# EAGLE design bar-graph-driver-16x9-ca-v2 (EAGLE 7.4.0)
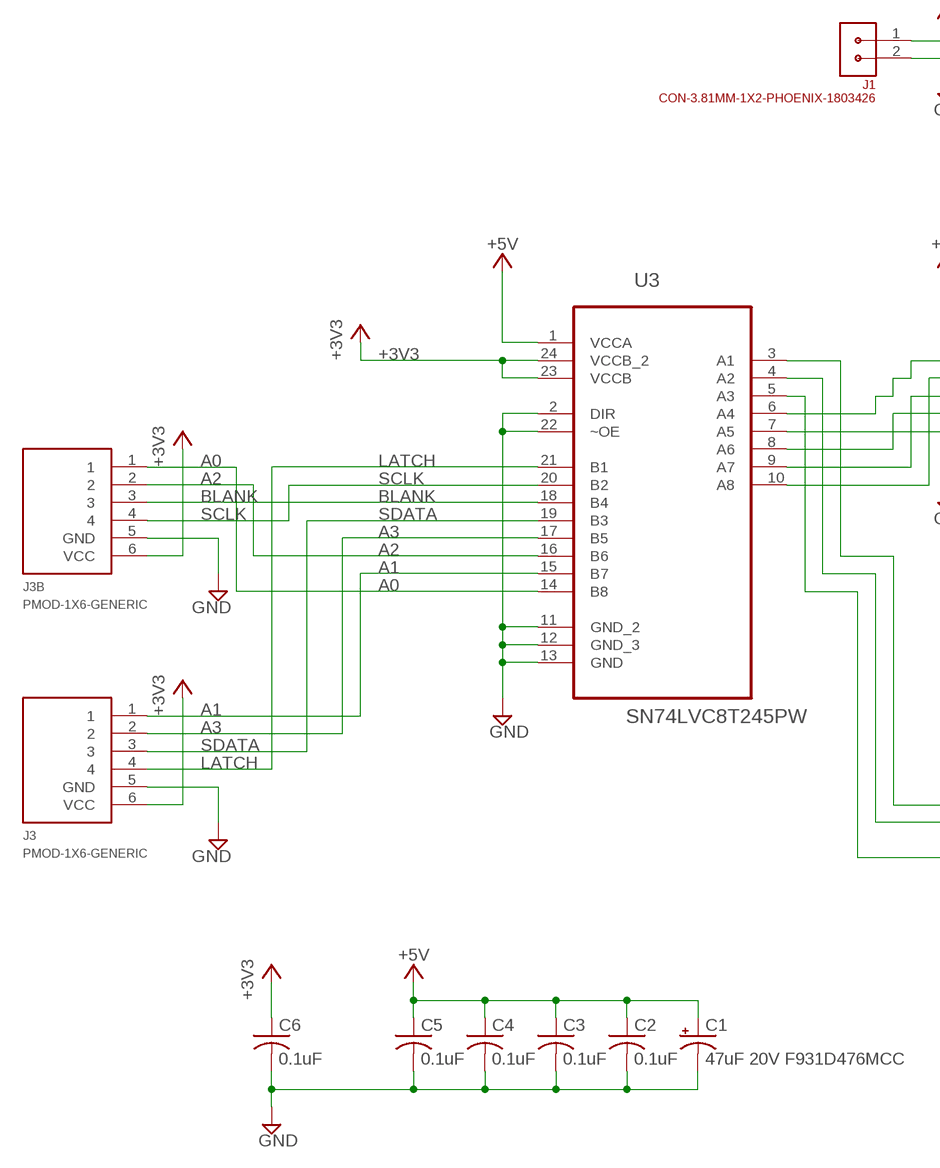
[diagram p0: schematic, sheet 1, part 1 of 2]
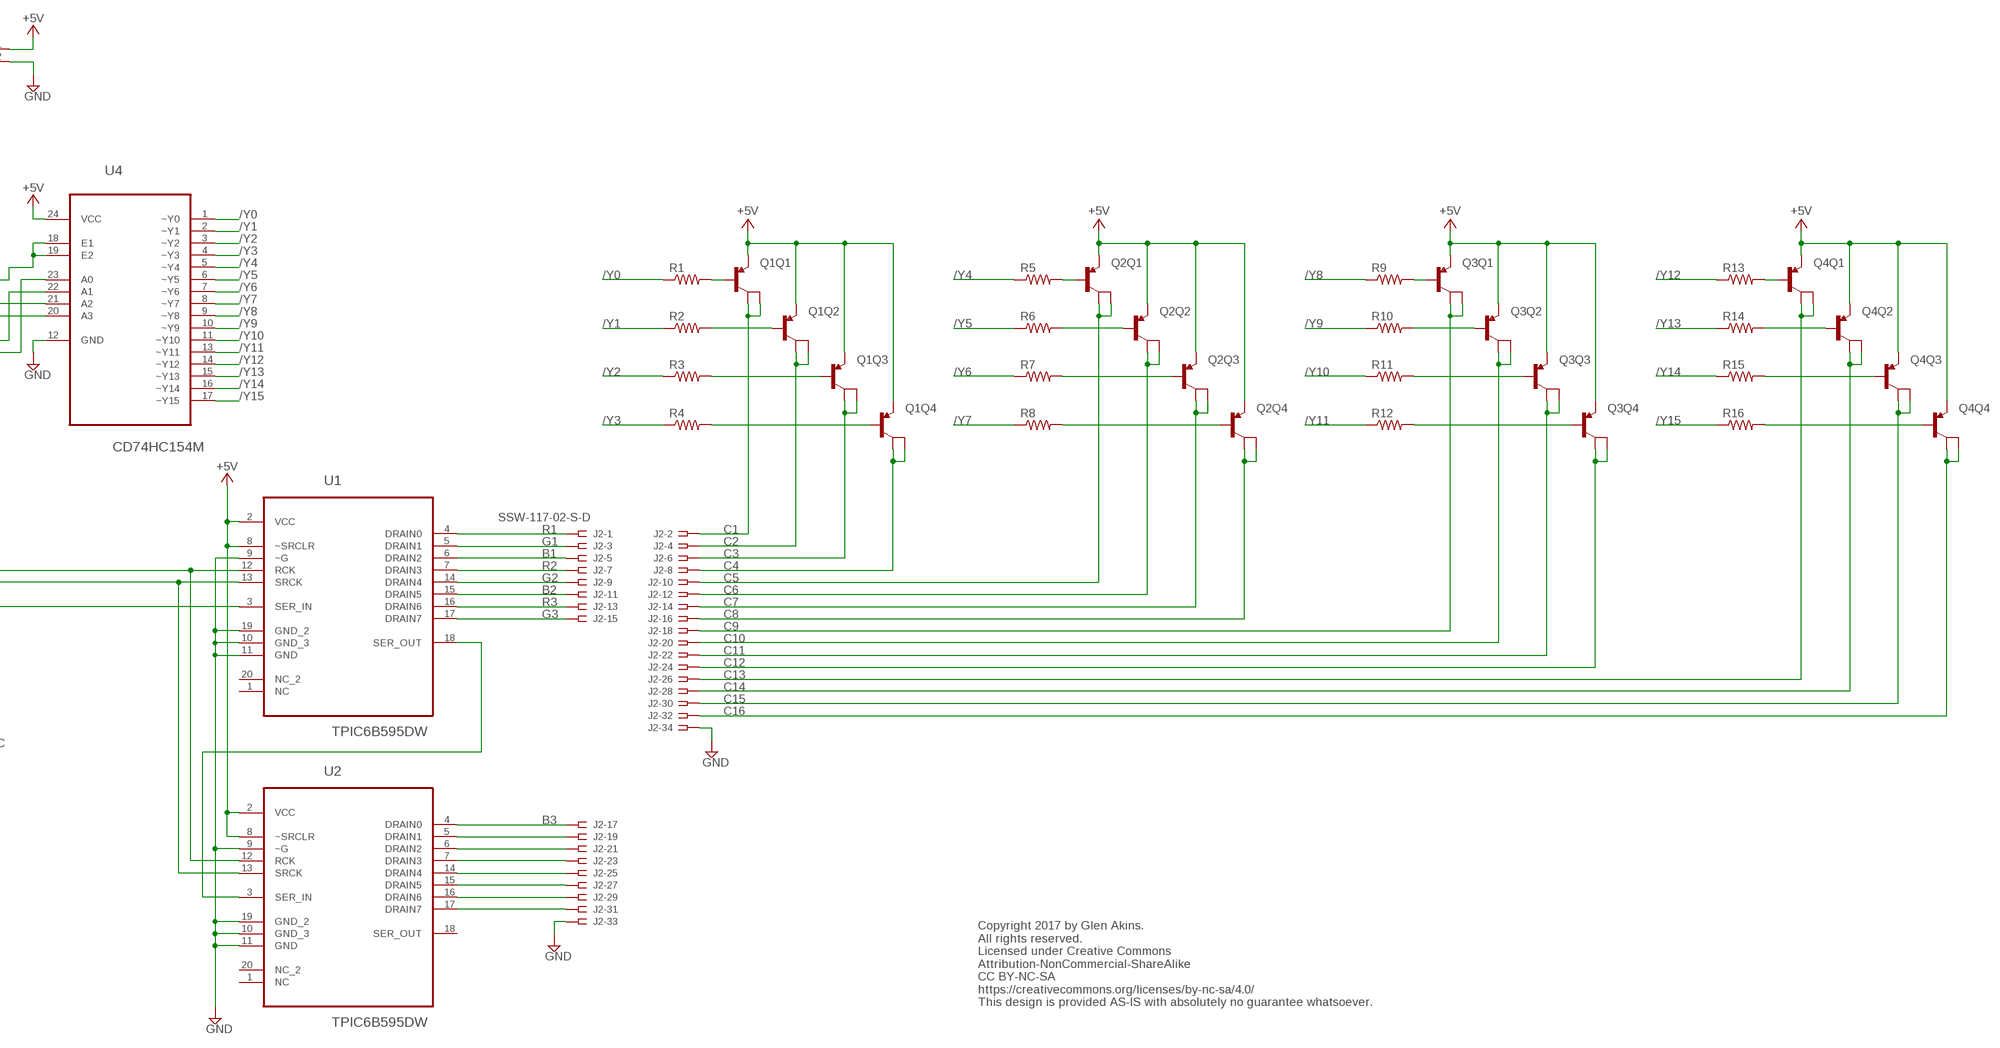
[diagram p1: schematic, sheet 1, part 2 of 2]

## Parts
C1  47uF 20V F931D476MCC  CPOL-USC/6032-28R  [C/6032-28R]
C2  0.1uF  C-USC1206  [C1206]
C3  0.1uF  C-USC1206  [C1206]
C4  0.1uF  C-USC1206  [C1206]
C5  0.1uF  C-USC1206  [C1206]
C6  0.1uF  C-USC1206  [C1206]
J1  CON-3.81MM-1X2-PHOENIX-1803426  [CON-PHOENIX-1803426-3.81-1X2]
J2  SSW-117-02-S-D  [SSW-117-02-S-D]
J3  PMOD-1X6-GENERIC  [CON-PMOD-1X6]
J3B  PMOD-1X6-GENERIC  [CON-PMOD-1X6]
Q1  MMPQ2907A  [SO16]
Q2  MMPQ2907A  [SO16]
Q3  MMPQ2907A  [SO16]
Q4  MMPQ2907A  [SO16]
R1  R-US_R1206  [R1206]
R2  R-US_R1206  [R1206]
R3  R-US_R1206  [R1206]
R4  R-US_R1206  [R1206]
R5  R-US_R1206  [R1206]
R6  R-US_R1206  [R1206]
R7  R-US_R1206  [R1206]
R8  R-US_R1206  [R1206]
R9  R-US_R1206  [R1206]
R10  R-US_R1206  [R1206]
R11  R-US_R1206  [R1206]
R12  R-US_R1206  [R1206]
R13  R-US_R1206  [R1206]
R14  R-US_R1206  [R1206]
R15  R-US_R1206  [R1206]
R16  R-US_R1206  [R1206]
U1  TPIC6B595DW  [SOIC127P1030X265-20N]
U2  TPIC6B595DW  [SOIC127P1030X265-20N]
U3  SN74LVC8T245PW  SN74AVC8T245PW  [SOP65P640X120-24N]
U4  CD74HC154M  [SOIC127P1030X265-24N]

## Nets
+3V3: C6.1 J3.6(VCC) J3B.6(VCC) U3.23(VCCB) U3.24(VCCB_2)
+5V: C1.+ C2.1 C3.1 C4.1 C5.1 J1.1 Q1.10(Q4:E) Q1.12(Q3:E) Q1.14(Q2:E) Q1.16(Q1:E) Q2.10(Q4:E) Q2.12(Q3:E) Q2.14(Q2:E) Q2.16(Q1:E) Q3.10(Q4:E) Q3.12(Q3:E) Q3.14(Q2:E) Q3.16(Q1:E) Q4.10(Q4:E) Q4.12(Q3:E) Q4.14(Q2:E) Q4.16(Q1:E) U1.2(VCC) U1.8(~SRCLR) U2.2(VCC) U2.8(~SRCLR) U3.1(VCCA) U4.24(VCC)
/Y0: R1.1 U4.1(~Y0)
/Y1: R2.1 U4.2(~Y1)
/Y2: R3.1 U4.3(~Y2)
/Y3: R4.1 U4.4(~Y3)
/Y4: R5.1 U4.5(~Y4)
/Y5: R6.1 U4.6(~Y5)
/Y6: R7.1 U4.7(~Y6)
/Y7: R8.1 U4.8(~Y7)
/Y8: R9.1 U4.9(~Y8)
/Y9: R10.1 U4.10(~Y9)
/Y10: R11.1 U4.11(~Y10)
/Y11: R12.1 U4.13(~Y11)
/Y12: R13.1 U4.14(~Y12)
/Y13: R14.1 U4.15(~Y13)
/Y14: R15.1 U4.16(~Y14)
/Y15: R16.1 U4.17(~Y15)
A0: J3B.1 U3.14(B8)
A0_5: U3.10(A8) U4.23(A0)
A1: J3.1 U3.15(B7)
A1_5: U3.9(A7) U4.22(A1)
A2: J3B.2 U3.16(B6)
A2_5: U3.8(A6) U4.21(A2)
A3: J3.2 U3.17(B5)
A3_5: U3.7(A5) U4.20(A3)
B1: J2.5 U1.6(DRAIN2)
B2: J2.11 U1.15(DRAIN5)
B3: J2.17 U2.4(DRAIN0)
BLANK: J3B.3 U3.18(B4)
BLANK_5: U3.6(A4) U4.18(E1) U4.19(E2)
C1: J2.2 Q1.1(Q1:C) Q1.2(Q1:C)
C2: J2.4 Q1.3(Q2:C) Q1.4(Q2:C)
C3: J2.6 Q1.5(Q3:C) Q1.6(Q3:C)
C4: J2.8 Q1.7(Q4:C) Q1.8(Q4:C)
C5: J2.10 Q2.1(Q1:C) Q2.2(Q1:C)
C6: J2.12 Q2.3(Q2:C) Q2.4(Q2:C)
C7: J2.14 Q2.5(Q3:C) Q2.6(Q3:C)
C8: J2.16 Q2.7(Q4:C) Q2.8(Q4:C)
C9: J2.18 Q3.1(Q1:C) Q3.2(Q1:C)
C10: J2.20 Q3.3(Q2:C) Q3.4(Q2:C)
C11: J2.22 Q3.5(Q3:C) Q3.6(Q3:C)
C12: J2.24 Q3.7(Q4:C) Q3.8(Q4:C)
C13: J2.26 Q4.1(Q1:C) Q4.2(Q1:C)
C14: J2.28 Q4.3(Q2:C) Q4.4(Q2:C)
C15: J2.30 Q4.5(Q3:C) Q4.6(Q3:C)
C16: J2.32 Q4.7(Q4:C) Q4.8(Q4:C)
G1: J2.3 U1.5(DRAIN1)
G2: J2.9 U1.14(DRAIN4)
G3: J2.15 U1.17(DRAIN7)
GND: C1.- C2.2 C3.2 C4.2 C5.2 C6.2 J1.2 J2.33 J2.34 J3.5(GND) J3B.5(GND) U1.9(~G) U1.10(GND_3) U1.11(GND) U1.19(GND_2) U2.9(~G) U2.10(GND_3) U2.11(GND) U2.19(GND_2) U3.2(DIR) U3.11(GND_2) U3.12(GND_3) U3.13(GND) U3.22(~OE) U4.12(GND)
LATCH: J3.4 U3.21(B1)
LATCH_5: U1.12(RCK) U2.12(RCK) U3.3(A1)
N$1: U1.18(SER_OUT) U2.3(SER_IN)
N$2: J2.19 U2.5(DRAIN1)
N$3: J2.21 U2.6(DRAIN2)
N$6: J2.23 U2.7(DRAIN3)
N$7: J2.25 U2.14(DRAIN4)
N$8: J2.27 U2.15(DRAIN5)
N$9: J2.29 U2.16(DRAIN6)
N$10: J2.31 U2.17(DRAIN7)
N$20: Q1.13(Q2:B) R2.2
N$82: Q1.11(Q3:B) R3.2
N$83: Q1.9(Q4:B) R4.2
N$84: Q1.15(Q1:B) R1.2
N$102: Q2.13(Q2:B) R6.2
N$103: Q2.11(Q3:B) R7.2
N$104: Q2.9(Q4:B) R8.2
N$105: Q2.15(Q1:B) R5.2
N$110: Q3.13(Q2:B) R10.2
N$111: Q3.11(Q3:B) R11.2
N$112: Q3.9(Q4:B) R12.2
N$113: Q3.15(Q1:B) R9.2
N$118: Q4.13(Q2:B) R14.2
N$119: Q4.11(Q3:B) R15.2
N$120: Q4.9(Q4:B) R16.2
N$121: Q4.15(Q1:B) R13.2
R1: J2.1 U1.4(DRAIN0)
R2: J2.7 U1.7(DRAIN3)
R3: J2.13 U1.16(DRAIN6)
SCLK: J3B.4 U3.20(B2)
SCLK_5: U1.13(SRCK) U2.13(SRCK) U3.4(A2)
SDATA: J3.3 U3.19(B3)
SDATA_5: U1.3(SER_IN) U3.5(A3)
Unconnected: U1.1(NC) U1.20(NC_2) U2.1(NC) U2.18(SER_OUT) U2.20(NC_2)

## Notes on the sheet
- Copyright 2017 by Glen Akins.
  All rights reserved.
  Licensed under Creative Commons
  Attribution-NonCommercial-ShareAlike
  CC BY-NC-SA
  https://creativecommons.org/licenses/by-nc-sa/4.0/
  This design is provided AS-IS with absolutely no guarantee whatsoever.

## Library data of the parts
C1 = rcl:CPOL-US: POLARIZED CAPACITOR, American symbol
C2-C6 = rcl:C-US: CAPACITOR, American symbol
J1 = 0GlenConnectors:CON-3.81MM-1X2-PHOENIX-1803426
J2 = con-samtec:SSW-117-02-S-D: THROUGH-HOLE .025" SQ POST SOCKET Source: Samtec SSW.pdf; MPN: SSW-117-02-S-D; OC_FARNELL: unknown; OC_NEWARK: 11P9590
J3 J3B = 0GlenConnectors:PMOD-1X6-GENERIC
Q1-Q4 = GlenPartsLibrary:MMPQ2907A
R1-R16 = rcl:R-US_: RESISTOR, American symbol
U1 U2 = Texas Instruments_By_element14_Batch_1:TPIC6B595DW: Power Logic 8-Bit Shift Register; MPN: TPIC6B595DW; OC_FARNELL: 1491696; OC_NEWARK: 52F2783; PACKAGE: SOIC-20; SUPPLIER: Texas Instruments
U3 = Texas Instruments_By_element14_Batch_1:SN74AVC8T245PW: TRANSCEIVER; MPN: SN74AVC8T245PW; OC_FARNELL: 1053490; OC_NEWARK: 10J9626; PACKAGE: TSSOP-24; SUPPLIER: Texas Instruments
U4 = Texas Instruments_By_element14_Batch_1:CD74HC154M: High-Speed CMOS Logic 4- to 16-Line Decoder/Demultiplexer; MPN: CD74HC154M; OC_FARNELL: 1640550; OC_NEWARK: 66F5185; PACKAGE: SOIC-24; SUPPLIER: Texas Instruments

## Board
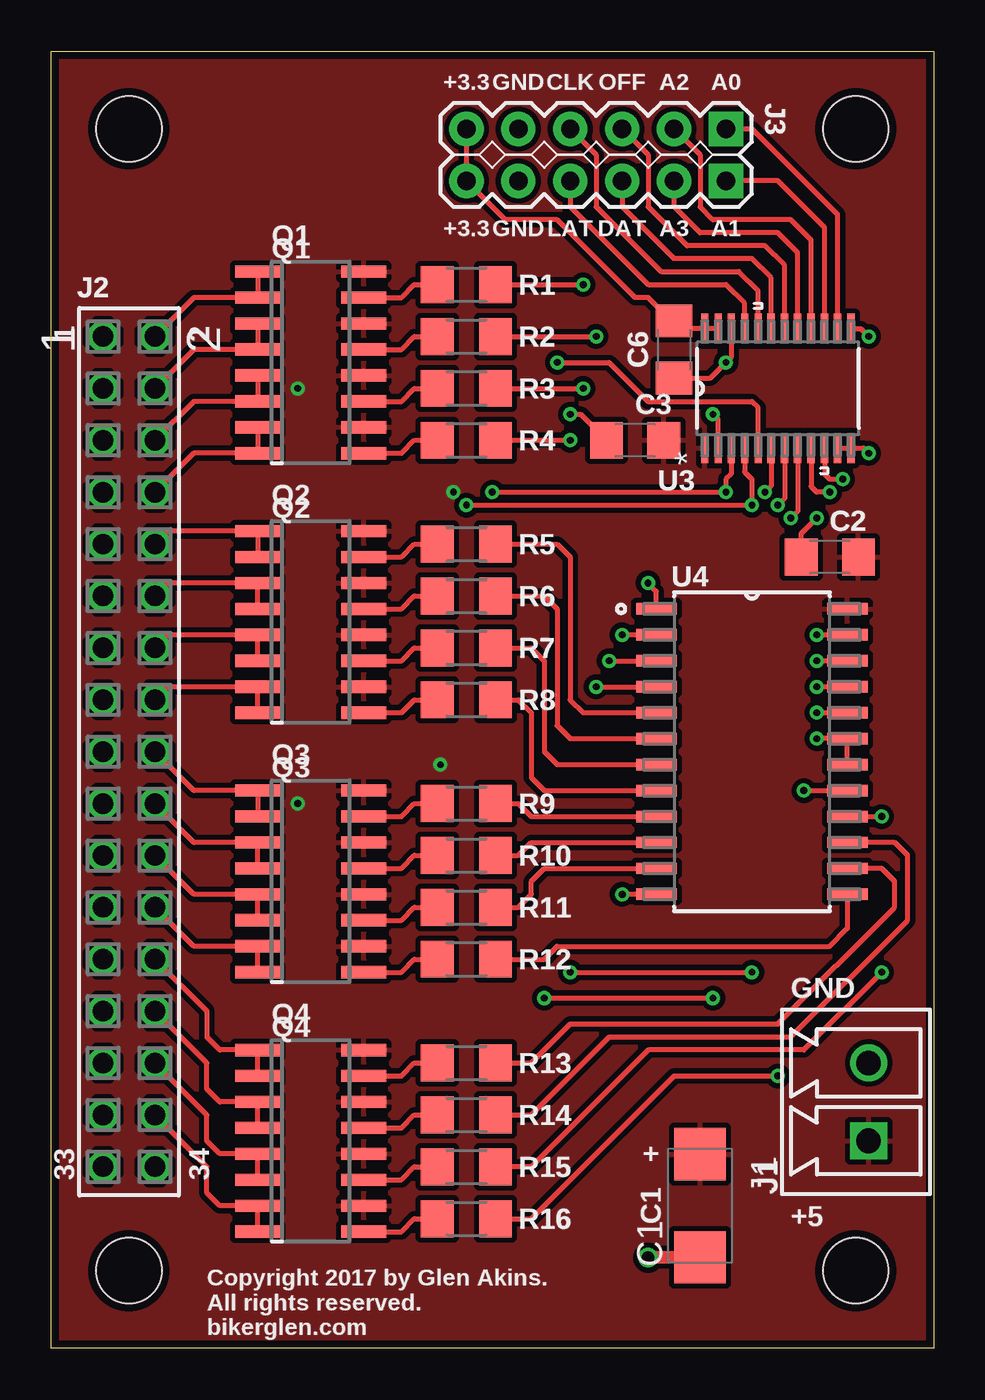
[diagram p2: board, top side]
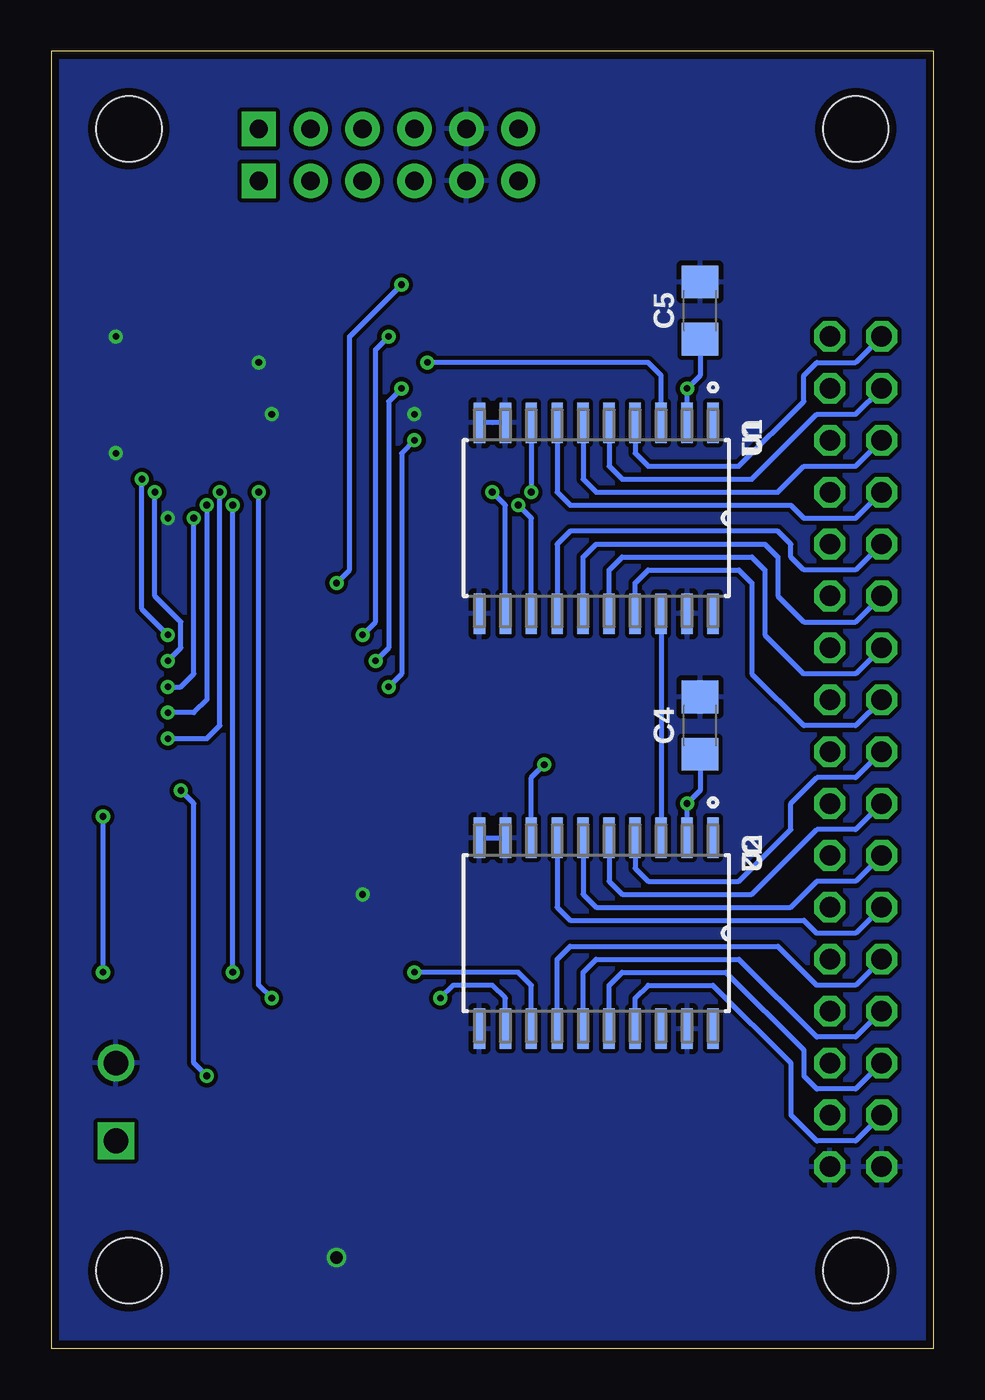
[diagram p3: board, bottom side, seen from below]

Size 43.18 x 63.5 mm. Coordinates in mm from the lower left corner, seen from the top.
Outline: 0,0 0,63.5 43.18,63.5 43.18,0 0,0
Copper layers (1*16): Top 0.0356mm / dielectric 1.5011mm / Bottom 0.0356mm
Design rules "oshpark-2layer": minimum track width 6mil, minimum drill 13mil, track to track 6mil, track to pad 6mil, pad to pad 6mil, via to via 6mil, smd to smd 6mil, copper to edge 15mil, drill to drill 6mil, minimum pad ring 7mil, minimum via ring 7mil, stop-mask expansion 2.5mil, vias tented up to drill 0mil, thermal gap 10mil
Holes 3.2 mm at 3.81,3.81 3.81,59.69 39.37,59.69 39.37,3.81

### Footprints (pad centres in the part's own frame; a part is rotated, then mirrored left to right if it is on the bottom)
C/6032-28R = smd 2.55 x 2.5: + 2.525,0; - -2.525,0
C1206 = smd 1.6 x 1.8: 1 -1.4,0; 2 1.4,0
CON-PHOENIX-1803426-3.81-1X2 = drill 1.2 square: 1 0,0 | drill 1.2: 2 3.81,0
SSW-117-02-S-D = drill 1 pad 1.5 octagon: 1 -20.32,-1.27; 2 -20.32,1.27; 3 -17.78,-1.27; 4 -17.78,1.27; 5 -15.24,-1.27; 6 -15.24,1.27; 7 -12.7,-1.27; 8 -12.7,1.27; 9 -10.16,-1.27; 10 -10.16,1.27; 11 -7.62,-1.27; 12 -7.62,1.27; 13 -5.08,-1.27; 14 -5.08,1.27; 15 -2.54,-1.27; 16 -2.54,1.27; 17 0,-1.27; 18 0,1.27; 19 2.54,-1.27; 20 2.54,1.27; 21 5.08,-1.27; 22 5.08,1.27; 23 7.62,-1.27; 24 7.62,1.27; 25 10.16,-1.27; 26 10.16,1.27; 27 12.7,-1.27; 28 12.7,1.27; 29 15.24,-1.27; 30 15.24,1.27; 31 17.78,-1.27; 32 17.78,1.27; 33 20.32,-1.27; 34 20.32,1.27
CON-PMOD-1X6 = drill 0.9 pad 1.676 square: 1 0,6.35 | drill 0.9 pad 1.676: 2 0,3.81; 3 0,1.27; 4 0,-1.27; 5 0,-3.81; 6 0,-6.35
SO16 = smd 0.6 x 2.2: 1 -4.445,-2.6; 2 -3.175,-2.6; 3 -1.905,-2.6; 4 -0.635,-2.6; 5 0.635,-2.6; 6 1.905,-2.6; 7 3.175,-2.6; 8 4.445,-2.6; 9 4.445,2.6; 10 3.175,2.6; 11 1.905,2.6; 12 0.635,2.6; 13 -0.635,2.6; 14 -1.905,2.6; 15 -3.175,2.6; 16 -4.445,2.6
R1206 = smd 1.6 x 1.803: 1 -1.422,0; 2 1.422,0
SOIC127P1030X265-20N = smd 1.981 x 0.559: 1 -4.674,5.715; 2 -4.674,4.445; 3 -4.674,3.175; 4 -4.674,1.905; 5 -4.674,0.635; 6 -4.674,-0.635; 7 -4.674,-1.905; 8 -4.674,-3.175; 9 -4.674,-4.445; 10 -4.674,-5.715; 11 4.674,-5.715; 12 4.674,-4.445; 13 4.674,-3.175; 14 4.674,-1.905; 15 4.674,-0.635; 16 4.674,0.635; 17 4.674,1.905; 18 4.674,3.175; 19 4.674,4.445; 20 4.674,5.715
SOP65P640X120-24N = smd 1.473 x 0.356: 1 -2.921,3.581; 2 -2.921,2.921; 3 -2.921,2.286; 4 -2.921,1.626; 5 -2.921,0.965; 6 -2.921,0.33; 7 -2.921,-0.33; 8 -2.921,-0.965; 9 -2.921,-1.626; 10 -2.921,-2.286; 11 -2.921,-2.921; 12 -2.921,-3.581; 13 2.921,-3.581; 14 2.921,-2.921; 15 2.921,-2.286; 16 2.921,-1.626; 17 2.921,-0.965; 18 2.921,-0.33; 19 2.921,0.33; 20 2.921,0.965; 21 2.921,1.626; 22 2.921,2.286; 23 2.921,2.921; 24 2.921,3.581
SOIC127P1030X265-24N = smd 1.981 x 0.559: 1 -4.674,6.985; 2 -4.674,5.715; 3 -4.674,4.445; 4 -4.674,3.175; 5 -4.674,1.905; 6 -4.674,0.635; 7 -4.674,-0.635; 8 -4.674,-1.905; 9 -4.674,-3.175; 10 -4.674,-4.445; 11 -4.674,-5.715; 12 -4.674,-6.985; 13 4.674,-6.985; 14 4.674,-5.715; 15 4.674,-4.445; 16 4.674,-3.175; 17 4.674,-1.905; 18 4.674,-0.635; 19 4.674,0.635; 20 4.674,1.905; 21 4.674,3.175; 22 4.674,4.445; 23 4.674,5.715; 24 4.674,6.985

### Placement (x,y rotation side)
C1  31.75,6.99 90 top
C2  38.1,38.73 180 top
C3  28.57,44.45 180 top
C4  11.43,30.48 90 bottom
C5  11.43,50.8 90 bottom
C6  30.48,48.9 270 top
J1  40.01,10.16 90 top
J2  3.81,29.21 270 top
J3  26.67,57.15 270 top
J3B  26.67,59.69 270 top
Q1  12.7,48.26 270 top
Q2  12.7,35.56 270 top
Q3  12.7,22.86 270 top
Q4  12.7,10.16 270 top
R1  20.32,52.07 180 top
R2  20.32,49.53 180 top
R3  20.32,46.99 180 top
R4  20.32,44.45 180 top
R5  20.32,39.37 180 top
R6  20.32,36.83 180 top
R7  20.32,34.29 180 top
R8  20.32,31.75 180 top
R9  20.32,26.67 180 top
R10  20.32,24.13 180 top
R11  20.32,21.59 180 top
R12  20.32,19.05 180 top
R13  20.32,13.97 180 top
R14  20.32,11.43 180 top
R15  20.32,8.89 180 top
R16  20.32,6.35 180 top
U1  16.51,40.64 270 bottom
U2  16.51,20.32 270 bottom
U3  35.56,46.99 90 top
U4  34.29,29.21 0 top

### Tracks (layer width: path | path; a pad name or v marks a point on that pad's centre or on a via)
+3V3
  Top 0.254: J3B.6 J3.6 22.23,55.24 24.77,55.24 28.57,51.44 29.21,51.44 30.35,50.3 C6.1 30.86,49.91 U3.24 U3.23
+5V  (via drill 0.33)
  Bottom 0.254: U2.2 v12.06,26.67 11.43,27.3 C4.1 | U1.2 v12.06,46.99 11.43,47.62 C5.1 | U1.8 v19.68,41.91 | U2.8 19.68,27.94 v19.05,28.57
  pour Top (isolate 0.254): 0,63.5 43.18,63.5 43.18,0 0,0
/Y0  (via drill 0.33)
  Top 0.254: R1.1 v26.04,52.07 | U4.1 29.62,37.06 v29.21,37.47
  Bottom 0.254: v29.21,37.47 28.57,38.1 28.57,49.53 v26.04,52.07
/Y1  (via drill 0.33)
  Top 0.254: R2.1 v26.67,49.53 | U4.2 v27.94,34.92
  Bottom 0.254: v27.94,34.92 27.3,35.56 27.3,48.9 v26.67,49.53
/Y2  (via drill 0.33)
  Top 0.254: R3.1 v26.04,46.99 | v27.3,33.66 U4.3
  Bottom 0.254: v26.04,46.99 26.67,46.35 26.67,34.29 v27.3,33.66
/Y3  (via drill 0.33)
  Top 0.254: R4.1 v25.4,44.45 | v26.67,32.38 U4.4
  Bottom 0.254: v25.4,44.45 26.04,43.81 26.04,33.02 v26.67,32.38
/Y4
  Top 0.254: R5.1 24.77,39.37 25.4,38.73 25.4,31.75 26.04,31.11 U4.5
/Y5
  Top 0.254: R6.1 24.13,36.83 24.77,36.2 24.77,30.48 25.4,29.84 U4.6
/Y6
  Top 0.254: R7.1 23.5,34.29 24.13,33.66 24.13,29.21 24.77,28.57 U4.7
/Y7
  Top 0.254: R8.1 22.86,31.75 23.5,31.11 23.5,27.94 24.13,27.3 U4.8
/Y8
  Top 0.254: R9.1 22.86,26.67 23.5,26.04 U4.9
/Y9
  Top 0.254: R10.1 22.86,24.13 23.5,24.77 U4.10
/Y10
  Top 0.254: R11.1 22.86,21.59 23.5,22.23 23.5,22.86 24.13,23.5 U4.11
/Y11
  Top 0.254: R12.1 24.13,19.05 24.77,19.68 38.1,19.68 38.96,20.55 U4.13
/Y12
  Top 0.254: R13.1 23.5,13.97 25.4,15.88 35.56,15.88 41.27,21.59 41.27,22.86 40.64,23.5 U4.14
/Y13
  Top 0.254: R14.1 23.5,11.43 27.3,15.24 36.2,15.24 41.91,20.95 41.91,24.13 41.27,24.77 U4.15
/Y14  (via drill 0.33)
  Top 0.254: U4.16 v40.64,26.04 | v40.64,18.41 36.83,14.61 29.21,14.61 23.5,8.89 R15.1
  Bottom 0.254: v40.64,18.41 v40.64,26.04
/Y15  (via drill 0.33)
  Top 0.254: v36.83,27.3 U4.17 | R16.1 23.5,6.35 30.48,13.34 v35.56,13.34
  Bottom 0.254: v35.56,13.34 36.2,13.97 36.2,26.67 v36.83,27.3
A0
  Top 0.254: J3B.1 34.29,59.69 38.48,55.5 U3.14
A0_5  (via drill 0.33)
  Top 0.254: U4.23 v37.47,34.92 | U3.10 37.85,42.8 38.1,42.55 v38.73,42.55
  Bottom 0.254: v37.47,34.92 38.73,36.2 v38.73,42.55
A1
  Top 0.254: J3.1 35.56,57.15 37.85,54.86 U3.15
A1_5  (via drill 0.33)
  Top 0.254: U4.22 v37.47,33.66 | v38.1,41.91 37.47,41.91 37.19,42.19 U3.9
  Bottom 0.254: v37.47,33.66 36.83,34.29 36.83,35.56 38.1,36.83 v38.1,41.91
A2
  Top 0.254: J3B.2 31.75,58.42 31.75,55.88 32.38,55.24 36.2,55.24 37.19,54.25 U3.16
A2_5  (via drill 0.33)
  Top 0.254: U4.21 v37.47,32.38 | U3.8 36.52,40.97 v36.2,40.64
  Bottom 0.254: v37.47,32.38 36.83,32.38 36.2,33.02 v36.2,40.64
A3
  Top 0.254: J3.2 30.48,55.88 31.75,54.61 35.56,54.61 36.52,53.65 U3.17
A3_5  (via drill 0.33)
  Top 0.254: U3.7 35.89,41.6 v35.56,41.27 | v37.47,31.11 U4.20
  Bottom 0.254: v35.56,41.27 35.56,31.75 36.2,31.11 v37.47,31.11
B1
  Bottom 0.254: J2.5 3.81,43.18 6.35,43.18 7.62,41.91 16.51,41.91 17.14,42.55 U1.6
B2
  Bottom 0.254: U1.15 17.14,38.73 16.51,39.37 8.26,39.37 7.62,38.73 7.62,36.83 6.35,35.56 3.81,35.56 J2.11
B3
  Bottom 0.254: J2.17 3.81,27.94 5.71,27.94 6.99,26.67 6.99,25.4 9.53,22.86 13.97,22.86 14.61,23.5 U2.4
BLANK
  Top 0.254: J3B.3 29.21,58.42 29.21,55.88 31.11,53.98 34.92,53.98 35.89,53.01 U3.18
BLANK_5  (via drill 0.33)
  Top 0.254: U4.18 U4.19 v37.47,29.84 | U3.6 35.23,42.22 v34.92,41.91
  Bottom 0.254: v37.47,29.84 35.56,29.84 34.92,30.48 v34.92,41.91
C1
  Top 0.254: Q1.1 Q1.2 6.99,51.44 J2.2
C2
  Top 0.254: Q1.3 Q1.4 6.99,48.9 J2.4
C3
  Top 0.254: Q1.5 Q1.6 6.99,46.35 J2.6
C4
  Top 0.254: Q1.7 Q1.8 6.99,43.81 J2.8
C5
  Top 0.254: J2.10 5.71,40.01 Q2.1 Q2.2
C6
  Top 0.254: J2.12 5.71,37.47 Q2.3 Q2.4
C7
  Top 0.254: J2.14 5.71,34.92 Q2.5 Q2.6
C8
  Top 0.254: J2.16 5.71,32.38 Q2.7 Q2.8
C9
  Top 0.254: J2.18 6.99,27.3 Q3.1 Q3.2
C10
  Top 0.254: J2.20 6.99,24.77 Q3.3 Q3.4
C11
  Top 0.254: J2.22 6.99,22.23 Q3.5 Q3.6
C12
  Top 0.254: J2.24 6.99,19.68 Q3.7 Q3.8
C13
  Top 0.254: Q4.2 Q4.1 8.26,14.61 7.62,15.24 7.62,16.51 J2.26
C14
  Top 0.254: Q4.4 Q4.3 8.26,12.06 7.62,12.7 7.62,13.97 J2.28
C15
  Top 0.254: Q4.6 Q4.5 8.26,9.53 7.62,10.16 7.62,11.43 J2.30
C16
  Top 0.254: Q4.8 Q4.7 8.26,6.99 7.62,7.62 7.62,8.89 J2.32
G1
  Bottom 0.254: U1.5 15.88,43.18 15.24,42.55 8.89,42.55 5.71,45.72 3.81,45.72 J2.3
G2
  Bottom 0.254: J2.9 3.81,38.1 6.35,38.1 6.99,38.73 6.99,39.37 7.62,40.01 17.78,40.01 18.41,39.37 U1.14
G3
  Bottom 0.254: J2.15 3.81,30.48 6.35,30.48 8.89,33.02 8.89,37.47 9.53,38.1 13.97,38.1 14.61,37.47 U1.17
GND  (via drill 0.33, 0.6)
  Top 0.254: U4.12 v27.94,22.23 | U3.13 39.62,49.91 v40.01,49.53 | v40.01,43.81 39.75,44.07 U3.12 U3.11 | U3.22 33.27,48.51 v33.02,48.26 32.26,47.49 C6.2 | C2.2 36.7,39.88 v37.47,40.64 | v25.4,45.72 25.91,45.72 C3.2 | U3.2 32.64,45.47 v32.38,45.72
  Top 0.61: C1.- 29.23,4.46 v29.21,4.45
  Bottom 0.254: U1.9 U1.10 | U2.10 U2.9
  pour Bottom (isolate 0.203): 0,63.5 43.18,63.5 43.18,0 0,0
LATCH
  Top 0.254: J3.4 25.4,55.88 29.21,52.07 33.02,52.07 33.93,51.16 U3.21
LATCH_5  (via drill 0.33)
  Top 0.254: v24.13,17.14 v32.38,17.14 | v21.59,41.91 v33.02,41.91 33.02,42.55 33.27,42.8 U3.3
  Bottom 0.254: U2.12 20.95,17.14 21.59,17.78 23.5,17.78 v24.13,17.14 | v32.38,17.14 33.02,17.78 v33.02,41.91 | U1.12 20.95,41.27 v21.59,41.91
N$1
  Bottom 0.254: U1.18 U2.3
N$2
  Bottom 0.254: J2.19 3.81,25.4 5.71,25.4 8.89,22.23 15.24,22.23 15.88,22.86 U2.5
N$3
  Bottom 0.254: J2.21 3.81,22.86 5.71,22.86 6.99,21.59 16.51,21.59 17.14,22.23 U2.6
N$6
  Bottom 0.254: J2.23 3.81,20.32 5.71,20.32 6.35,20.95 17.78,20.95 18.41,21.59 U2.7
N$7
  Bottom 0.254: J2.25 3.81,17.78 5.71,17.78 7.62,19.68 17.78,19.68 18.41,19.05 U2.14
N$8
  Bottom 0.254: J2.27 3.81,15.24 5.71,15.24 9.53,19.05 16.51,19.05 17.14,18.41 U2.15
N$9
  Bottom 0.254: J2.29 3.81,12.7 5.71,12.7 6.35,13.34 6.35,14.61 10.16,18.41 15.24,18.41 15.88,17.78 U2.16
N$10
  Bottom 0.254: J2.31 3.81,10.16 5.71,10.16 6.99,11.43 6.99,13.97 10.79,17.78 13.97,17.78 14.61,17.14 U2.17
N$20
  Top 0.254: Q1.13 17.14,48.9 17.78,49.53 R2.2
N$82
  Top 0.254: Q1.11 17.14,46.35 17.78,46.99 R3.2
N$83
  Top 0.254: Q1.9 17.14,43.81 17.78,44.45 R4.2
N$84
  Top 0.254: Q1.15 17.14,51.44 17.78,52.07 R1.2
N$102
  Top 0.254: Q2.13 17.14,36.2 17.78,36.83 R6.2
N$103
  Top 0.254: Q2.11 17.14,33.66 17.78,34.29 R7.2
N$104
  Top 0.254: Q2.9 17.14,31.11 17.78,31.75 R8.2
N$105
  Top 0.254: Q2.15 17.14,38.73 17.78,39.37 R5.2
N$110
  Top 0.254: Q3.13 17.14,23.5 17.78,24.13 R10.2
N$111
  Top 0.254: Q3.11 17.14,20.95 17.78,21.59 R11.2
N$112
  Top 0.254: Q3.9 17.14,18.41 17.78,19.05 R12.2
N$113
  Top 0.254: Q3.15 17.14,26.04 17.78,26.67 R9.2
N$118
  Top 0.254: Q4.13 17.14,10.79 17.78,11.43 R14.2
N$119
  Top 0.254: Q4.11 17.14,8.26 17.78,8.89 R15.2
N$120
  Top 0.254: Q4.9 17.14,5.71 17.78,6.35 R16.2
N$121
  Top 0.254: Q4.15 17.14,13.34 17.78,13.97 R13.2
R1
  Bottom 0.254: J2.1 3.81,48.26 5.71,48.26 6.35,47.62 6.35,46.35 9.53,43.18 13.97,43.18 14.61,43.81 U1.4
R2
  Bottom 0.254: J2.7 3.81,40.64 6.35,40.64 6.99,41.27 17.78,41.27 18.41,41.91 U1.7
R3
  Bottom 0.254: J2.13 3.81,33.02 6.35,33.02 8.26,34.92 8.26,38.1 8.89,38.73 15.24,38.73 15.88,38.1 U1.16
SCLK
  Top 0.254: J3B.4 26.67,58.42 26.67,55.88 29.84,52.7 33.66,52.7 34.59,51.77 U3.20
SCLK_5  (via drill 0.33)
  Top 0.254: v25.4,18.41 v34.29,18.41 | v20.32,41.27 v34.29,41.27 34.29,42.55 33.93,42.9 U3.4
  Bottom 0.254: U2.13 19.68,17.78 20.32,18.41 v25.4,18.41 | v34.29,18.41 v34.29,41.27 | U1.13 19.68,40.64 v20.32,41.27
SDATA
  Top 0.254: J3.3 27.94,55.88 30.48,53.34 34.29,53.34 35.23,52.4 U3.19
SDATA_5  (via drill 0.33)
  Top 0.254: v24.77,48.26 27.3,48.26 29.21,46.35 34.29,46.35 34.59,46.05 U3.5
  Bottom 0.254: U1.3 13.34,47.62 13.97,48.26 v24.77,48.26

### Text on the board
_tsilk: +3.3 | GND | CLK | OFF | A2 | A0 | J3 | +3.3 | GND | LAT | DAT | A3 | A1 | Q1 | R1 | J2 | 1 | 2 | R2 | C6 | R3 | C3 | R4 | U3 | Q2 | C2 | R5 | R6 | U4 | R7 | R8 | Q3 | R9 | R10 | R11 | R12 | GND | Q4 | R13 | R14 | + | 33 | 34 | R15 | J1 | C1 | +5 | R16 | Copyright 2017 by Glen Akins. / All rights reserved. / bikerglen.com
_bsilk: C5 | U1 | C4 | U2